# EAGLE schematic board (EAGLE 6.5.0)
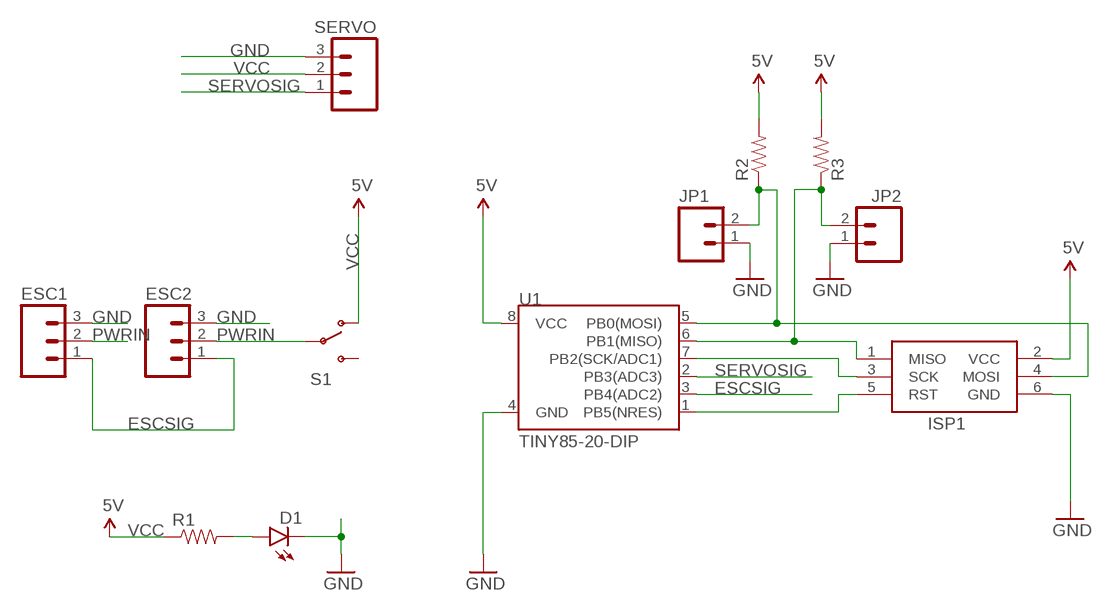
[diagram p0: schematic, sheet 1]

## Parts
D1  LED3MM  [LED3MM]
ESC1  M03POGO_PIN_HOLES_ONLY  [1X03_PP_HOLES_ONLY]
ESC2  M03POGO_PIN_HOLES_ONLY  [1X03_PP_HOLES_ONLY]
ISP1  AVRISP-6  [AVRISP]
JP1  M02PTH  [1X02]
JP2  M02PTH  [1X02]
R1  RESISTOR0805-RES  [0805]
R2  RESISTOR0805-RES  [0805]
R3  RESISTOR0805-RES  [0805]
S1  SWITCH-SPDTPTH  [SWITCH-SPDT]
SERVO  M03POGO_PIN_HOLES_ONLY  [1X03_PP_HOLES_ONLY]
U1  TINY85-20-DIP  ATTINY45TINY85-20-DIP  [DIP08]

## Nets
5V: ISP1.2(VCC) R2.2 R3.2 U1.8(VCC)
ESCSIG: ESC1.1 ESC2.1 U1.3(PB4(ADC2))
GND: D1.K(C) ESC1.3 ESC2.3 ISP1.6(GND) JP1.1 JP2.1 SERVO.3 U1.4(GND)
N$1: D1.A R1.2
N$3: ISP1.4(MOSI) JP1.2 R2.1 U1.5(PB0(MOSI))
N$4: ISP1.1(MISO) JP2.2 R3.1 U1.6(PB1(MISO))
N$7: ISP1.5(RST) U1.1(PB5(NRES))
N$8: ISP1.3(SCK) U1.7(PB2(SCK/ADC1))
PWRIN: ESC1.2 ESC2.2 S1.2(P)
SERVOSIG: SERVO.1 U1.2(PB3(ADC3))
VCC: R1.1 S1.1(O) SERVO.2 ; supply symbol labelled 5V
Unconnected: S1.3(S)

## Library data of the parts
D1 = SparkFun-LED:LED: LEDs Standard schematic elements and footprints for 5mm, 3mm, 1206, and 0603 sized LEDs. 5mm - Spark Fun Electronics SKU : COM-00529 (and others)
ESC1 ESC2 SERVO = SparkFun-Connectors:M03: Header 3 Standard 3-pin 0.1" header. Use with straight break away headers (SKU : PRT-00116), right angle break away headers (PRT-00553), swiss pins (PRT-00743), machine pins (PRT-00117), and female headers (PRT-00115). Molex polarized connector foot print use with SKU : PRT-08232 with associated crimp pins and housings.
ISP1 = adafruit:AVRISP: AVR ISP HEADER Standard 6 pin header for AVR programming
JP1 JP2 = SparkFun-Connectors:M02: Standard 2-pin 0.1" header. Use with - straight break away headers ( PRT-00116) - right angle break away headers (PRT-00553) - swiss pins (PRT-00743) - machine pins (PRT-00117) - female headers (PRT-00115) Molex polarized connector foot print use with: PRT-08233 with associated crimp pins and housings. 2.54_SCREWTERM for use with PRT-10571. 3.5mm Screw Terminal footprints for PRT-08084 5mm Screw Terminal footprints for use with PRT-08432
R1-R3 = SparkFun-Passives:RESISTOR: Resistor Basic schematic elements and footprints for 0603, 1206, and PTH resistors.
S1 = SparkFun-Electromechanical:SWITCH-SPDT: SPDT Switch Simple slide switch, Spark Fun Electronics SKU : COM-00102 DPDT SMT slide switch, AYZ0202, SWCH-08179; PROD_ID: SWCH-08261
U1 = SparkFun-DigitalIC:ATTINY45: Atmel 8-pin 2/4/8kB flash uC; PROD_ID: IC-09445